# EasyEDA Pro project 课设作业.eprj, schematic Schematic1
Board Name: Board1; Create Date: 2025-06-27; Page Name: P1; Project Name: 课设作业; Schematic Name: Schematic1; Update Date: 2025-06-27; Company: 嘉立创EDA; Page Size: A4; Version: V1.0
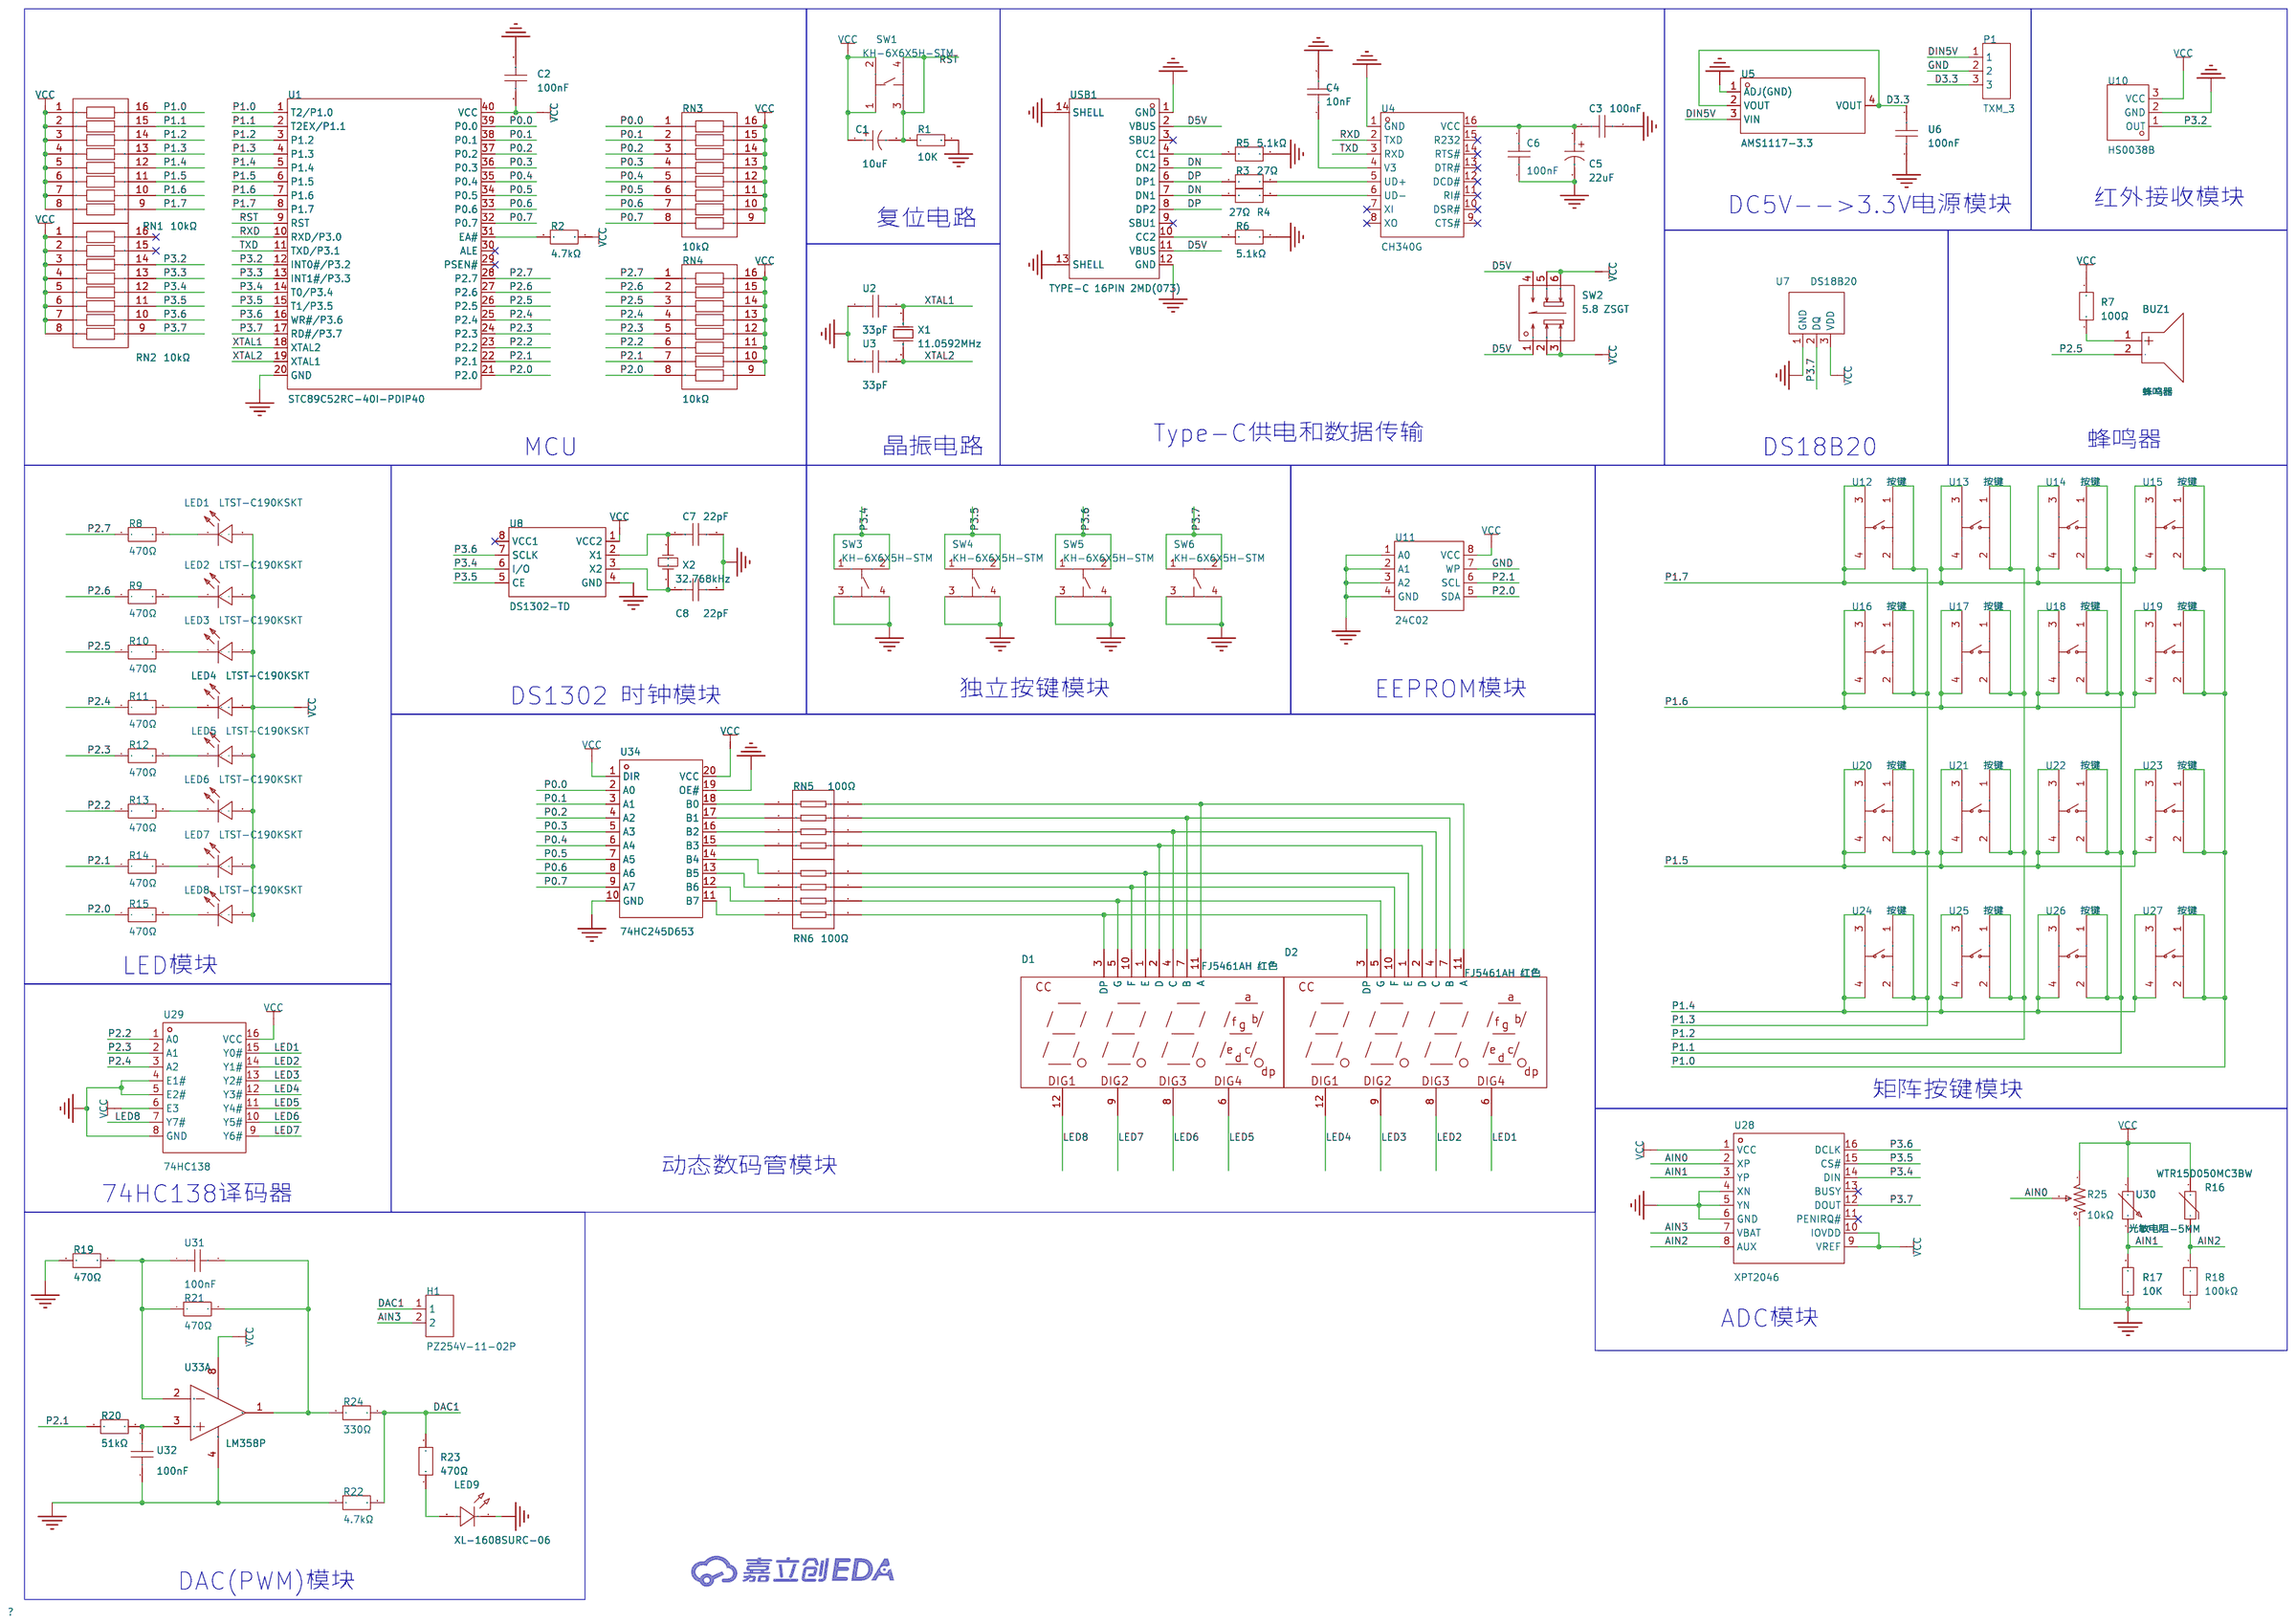
[diagram p0: schematic sheet]

## Parts
BUZ1  蜂鸣器  [BUZ-TH_BD9.0-P5.00-D0.6-FD]
C1  10uF  [CAP-TH_BD10.0-P5.00-D0.6-FD_1]
C2  100nF  [C0603]
C3  100nF  [C0603]
C4  10nF  [C0603]
C5  22uF  [CAP-SMD_BD5.0-L5.3-W5.3-LS6.0-FD-H5.7]
C6  100nF  [C0603]
C7  22pF  [C0603]
C8  22pF  [C0603]
D1  FJ5461AH 红色  [LED-SEG-TH_FJ5461AH]
D2  FJ5461AH 红色  [LED-SEG-TH_FJ5461AH]
H1  PZ254V-11-02P  [HDR-TH_2P-P2.54-V-M]
LED1  LTST-C190KSKT  [LED0603-RD]
LED2  LTST-C190KSKT  [LED0603-RD]
LED3  LTST-C190KSKT  [LED0603-RD]
LED4  LTST-C190KSKT  [LED0603-RD]
LED5  LTST-C190KSKT  [LED0603-RD]
LED6  LTST-C190KSKT  [LED0603-RD]
LED7  LTST-C190KSKT  [LED0603-RD]
LED8  LTST-C190KSKT  [LED0603-RD]
LED9  XL-1608SURC-06  [LED0603-RD_RED]
P1  TXM_3  [HDR-TH_3P-P2.54-V-M-A]
R1  10K  [R0603]
R2  4.7kΩ  [R0805]
R3  27Ω  [R0805]
R4  27Ω  [R0805]
R5  5.1kΩ  [R0603]
R6  5.1kΩ  [R0603]
R7  100Ω  [R1206]
R8  470Ω  [R0402]
R9  470Ω  [R0402]
R10  470Ω  [R0402]
R11  470Ω  [R0402]
R12  470Ω  [R0402]
R13  470Ω  [R0402]
R14  470Ω  [R0402]
R15  470Ω  [R0402]
R16  WTR15D050MC3BW  [RES-TH_L17.5-W6.0-P7.50-D0.8-S5.20]
R17  10K  [R0603]
R18  100kΩ  [R1206]
R19  470Ω  [R0402]
R20  51kΩ  [R1812]
R21  470Ω  [R0402]
R22  4.7kΩ  [R0603]
R23  470Ω  [R0402]
R24  330Ω  [R2010]
R25  10kΩ  [RES-ADJ-SMD_RM065-V1]
RN1  10kΩ  [DIP-16_L22.0-W6.7-P2.54-LS7.6-BL]
RN2  10kΩ  [DIP-16_L22.0-W6.7-P2.54-LS7.6-BL]
RN3  10kΩ  [DIP-16_L22.0-W6.7-P2.54-LS7.6-BL]
RN4  10kΩ  [DIP-16_L22.0-W6.7-P2.54-LS7.6-BL]
RN5  100Ω  [RES-ARRAY-SMD_0402-8P-L2.0-W1.0-BL]
RN6  100Ω  [RES-ARRAY-SMD_0402-8P-L2.0-W1.0-BL]
SW1  KH-6X6X5H-STM  [SW-SMD_4P-L6.0-W6.0-P4.50-LS9.0_H5.0]
SW2  5.8 ZSGT  [SW-TH_5.8ZSGT]
SW3  KH-6X6X5H-STM  [SW-SMD_4P-L6.0-W6.0-P4.50-LS9.0_H5.0]
SW4  KH-6X6X5H-STM  [SW-SMD_4P-L6.0-W6.0-P4.50-LS9.0_H5.0]
SW5  KH-6X6X5H-STM  [SW-SMD_4P-L6.0-W6.0-P4.50-LS9.0_H5.0]
SW6  KH-6X6X5H-STM  [SW-SMD_4P-L6.0-W6.0-P4.50-LS9.0_H5.0]
U1  STC89C52RC-40I-PDIP40  [DIP-40_L52.0-W13.7-P2.54-LS15.2-BL]
U2  33pF  [C0603]
U3  33pF  [C0603]
U4  CH340G  [SOIC-16_L9.9-W3.9-P1.27-LS6.0-BL]
U5  AMS1117-3.3  [SOT-223-3_L6.5-W3.4-P2.30-LS7.0-BR]
U6  100nF  [C0603]
U7  DS18B20  [TO-92-3_L4.6-W3.6-P1.27-L-1]
U8  DS1302-TD  [SOP-8_L4.9-W3.9-P1.27-LS6.0-BL]
U10  HS0038B  [OPTO-TH_HS0038B-A]
U11  24C02  [SOP-8_L4.9-W3.9-P1.27-LS6.0-BL]
U12  按键  [SW-SMD_4P-L6.0-W6.0-P4.50-LS9.0-2]
U13  按键  [SW-SMD_4P-L6.0-W6.0-P4.50-LS9.0-2]
U14  按键  [SW-SMD_4P-L6.0-W6.0-P4.50-LS9.0-2]
U15  按键  [SW-SMD_4P-L6.0-W6.0-P4.50-LS9.0-2]
U16  按键  [SW-SMD_4P-L6.0-W6.0-P4.50-LS9.0-2]
U17  按键  [SW-SMD_4P-L6.0-W6.0-P4.50-LS9.0-2]
U18  按键  [SW-SMD_4P-L6.0-W6.0-P4.50-LS9.0-2]
U19  按键  [SW-SMD_4P-L6.0-W6.0-P4.50-LS9.0-2]
U20  按键  [SW-SMD_4P-L6.0-W6.0-P4.50-LS9.0-2]
U21  按键  [SW-SMD_4P-L6.0-W6.0-P4.50-LS9.0-2]
U22  按键  [SW-SMD_4P-L6.0-W6.0-P4.50-LS9.0-2]
U23  按键  [SW-SMD_4P-L6.0-W6.0-P4.50-LS9.0-2]
U24  按键  [SW-SMD_4P-L6.0-W6.0-P4.50-LS9.0-2]
U25  按键  [SW-SMD_4P-L6.0-W6.0-P4.50-LS9.0-2]
U26  按键  [SW-SMD_4P-L6.0-W6.0-P4.50-LS9.0-2]
U27  按键  [SW-SMD_4P-L6.0-W6.0-P4.50-LS9.0-2]
U28  XPT2046  [TSSOP-16_L5.0-W4.4-P0.65-LS6.4-BL]
U29  74HC138  [SOIC-16_L9.9-W3.9-P1.27-LS6.0-BL]
U30  光敏电阻-5MM  [RES-TH_L4.9-W4.3-P3.4]
U31  100nF  [C0603]
U32  100nF  [C0603]
U33  LM358P  [DIP-8_L9.7-W6.4-P2.54-LS7.6-BL]  (section 1)
U34  74HC245D653  [SOIC-20_L13.0-W7.6-P1.27-LS10.3-BL]
USB1  TYPE-C 16PIN 2MD(073)  [USB-C-SMD_TYPE-C-6PIN-2MD-073]
X1  11.0592MHz  [HC-49US_L11.5-W4.5-P4.88]
X2  32.768kHz  [OSC-TH_BD3.1-P0.8-D0.3]

## Library data of the parts
BUZ1 = 蜂鸣器: Supplier Part: C9900020875; Supplier Footprint: 插件; JLCPCB Part Class: 扩展库; Supplier: LCSC
C1 = CV100MPA16B: LCSC Part Name: 10uF ±20% 450V; Supplier Part: C911241; Manufacturer: TWBOR(伯鸿); Supplier Footprint: 插件,D10xL16mm; JLCPCB Part Class: 扩展库; Datasheet: https://atta.szlcsc.com/upload/public/pdf/source/20201117/C911241_08C53D140102C9DE5D4425A5E1B3FE4F.pdf; Supplier: LCSC; Tolerance: ±20%; Voltage Rating: 450V; Ripple Current: 200mA@100kHz; Equivalent Series Resistance(ESR): 9Ω@100kHz; Pin Spacing: 5mm; Diameter: 10mm; Height - Seated (Max): 16mm; Lifetime: 5000hrs@105℃; Operating Temperature: -25℃~+105℃
C2 C3 C6 = 0603X7R104K250NT: 容值:100nF;精度:±10%;额定电压:25V;温度系数:X7R;; LCSC Part Name: 100nF ±10% 25V; Supplier Part: C48579280; Manufacturer: AIDE(爱迪电容); Supplier Footprint: 0603; JLCPCB Part Class: 扩展库; Datasheet: https://atta.szlcsc.com/upload/public/pdf/source/20210330/C2691711_5D01E1D4D7BF54205139C8425089DFE9.pdf; Supplier: LCSC; Tolerance: ±10%; Voltage Rating: 25V; Temperature Coefficient: X7R
C4 = C0603X103K2RECAUTO: 容值:10nF;精度:±10%;额定电压:200V;温度系数:X7R;; LCSC Part Name: 10nF ±10% 200V; Supplier Part: C2179446; Manufacturer: KEMET(基美); Supplier Footprint: 0603; JLCPCB Part Class: 扩展库; Datasheet: https://atta.szlcsc.com/upload/public/pdf/source/20210401/9EB15DD54C62581D346AFC10D664EB43.pdf; Supplier: LCSC; Tolerance: ±10%; Voltage Rating: 200V; Temperature Coefficient: X7R
C5 = JVE35V22M5X6: 容值:22uF;精度:±20%;额定电压:35V;纹波电流:95mA@120Hz;等效串联电阻(ESR):1.8Ω;; LCSC Part Name: 22uF ±20% 35V; Supplier Part: C48615118; Manufacturer: 捷而瑞; Supplier Footprint: SMD,D5xL5.7mm; JLCPCB Part Class: 扩展库; Datasheet: https://atta.szlcsc.com/upload/public/pdf/source/20250526/77E8EF678E4424190D47C2A54E1D535C.pdf; Supplier: LCSC; Tolerance: ±20%; Voltage Rating: 35V; Ripple Current: 95mA@120Hz; Equivalent Series Resistance(ESR): 1.8Ω; Diameter: 5mm; Height - Seated (Max): 5.7mm; Operating Temperature: -55℃~+105℃
C7 C8 = C0603C220K4GACAUTO: 容值:22pF;精度:±10%;额定电压:16V;温度系数:C0G;; LCSC Part Name: 22pF ±10% 16V; Supplier Part: C3895371; Manufacturer: KEMET(基美); Supplier Footprint: 0603; JLCPCB Part Class: 扩展库; Datasheet: https://atta.szlcsc.com/upload/public/pdf/source/20240118/0C4544E56C9B5C380B59302B893D963C.pdf; Supplier: LCSC; Tolerance: ±10%; Voltage Rating: 16V; Temperature Coefficient: C0G
D1 D2 = FJ5461AH 红色: LCSC Part Name: 4位0.56英寸红色数码管 共阴极; Supplier Part: C54396; Manufacturer: 志浩; Supplier Footprint: 插件; JLCPCB Part Class: 扩展库; Datasheet: https://atta.szlcsc.com/upload/public/pdf/source/20151111/1457707576636.pdf; Supplier: LCSC; Number of Characters: 4位; Display Type: 7段; Luminous Color: 红色; LED Polarity: 共阴极; Digit/Alpha Size(inch): 0.56
H1 = PZ254V-11-02P: LCSC Part Name: 1x2P 间距:2.54mm 方针 直插; Supplier Part: C492401; Manufacturer: XFCN(兴飞); Supplier Footprint: 插件,P=2.54mm; JLCPCB Part Class: 扩展库; Datasheet: https://atta.szlcsc.com/upload/public/pdf/source/20200309/C492401_A812433581A9B211A7FFA413ADDFF0E5.pdf; Supplier: LCSC; Pin Structure: 1x2P; Pitch: 2.54mm; Circluar Pins/Square Pins: 方针; Mounting Type: 直插; Number of Rows: 单排; Number of Pins: 2P; Length of Mating Pin: 6mm; Insulation Height: 2.5mm; Length of End Connection Pin: 3mm; Contact Material: 黄铜; Operating Temperature: -40℃~+105℃; Color: 黑色
LED1-LED8 = LTST-C190KSKT: 发光颜色:黄色;正向电压(VF):2.1V;功率:75mW;正向电流:20mA;主波长:584.5nm~597nm;二极管配置:-;透镜颜色:无色透明透镜;色温:-;发光强度:104mcd;发光角度:130°;载带方式:-;工作温度:-30℃~+85℃;; LCSC Part Name: 黄灯; Supplier Part: C125095; Manufacturer: LITEON(光宝); Supplier Footprint: 0603; JLCPCB Part Class: 扩展库; Datasheet: https://atta.szlcsc.com/upload/public/pdf/source/20180129/C125095_15171881843821315881.pdf; Supplier: LCSC; Emitted Color: 黄色; Forward Voltage (VF): 2.1V; Power Dissipation: 75mW; Forward Current: 20mA; Dominant Wavelength: 584.5nm~597nm; Peak Wavelength: 588nm; Lens Color: 无色透明透镜; Luminous Intensity: 104mcd; Viewing Angle: 130°; Operating Temperature: -30℃~+85℃
LED9 = XL-1608SURC-06: Supplier Part: C965799; Manufacturer: XINGLIGHT(成兴光); Supplier Footprint: 0603; JLCPCB Part Class: 扩展库; Datasheet: https://atta.szlcsc.com/upload/public/pdf/source/20250213/F9766CE804AF391355DCDD48DB3E0DAB.pdf; Supplier: LCSC; Illumination Color: 红色; Voltage - Forward(Vf): 2.3V; Power(Watts): 50mW; Forward Current: 20mA; Wavelength - Dominant: 620nm~630nm; Peak Wavelength: 625nm; Lens Color: 无色透明透镜; Luminous Intensity: 225mcd; Viewing Angle: 120°; Mounting Sytle: 正贴; Operating Temperature: -20℃~+85℃
P1 = TXM_3: Supplier Part: C9900014923; Supplier Footprint: 排针; JLCPCB Part Class: 扩展库; Supplier: LCSC
R1 R17 = Res_0603: Supplier Footprint: 0603
R2 = ERJ-U06F4701V: 电阻类型:厚膜电阻;阻值:4.7kΩ;精度:±1%;功率:125mW;工作电压:-;温度系数:±100ppm/℃;; LCSC Part Name: 4.7kΩ ±1% 125mW 厚膜电阻; Supplier Part: C1859462; Manufacturer: PANASONIC(松下); Supplier Footprint: 0805; JLCPCB Part Class: 扩展库; Datasheet: https://atta.szlcsc.com/upload/public/pdf/source/20210624/C1859462_0DC8A541405FCF91B34CFE3F505433C6.pdf; Supplier: LCSC; Type: 厚膜电阻; Tolerance: ±1%; Power(Watts): 125mW; Temperature Coefficient: ±100ppm/℃; Operating Temperature: -55℃~+155℃
R3 R4 = FRC0805J270 TS: 电阻类型:厚膜电阻;阻值:27Ω;精度:±5%;功率:125mW;工作电压:150V;温度系数:±100ppm/℃;; LCSC Part Name: 27Ω ±5% 125mW 厚膜电阻; Supplier Part: C2907314; Manufacturer: FOJAN(富捷); Supplier Footprint: 0805; JLCPCB Part Class: 扩展库; Datasheet: https://atta.szlcsc.com/upload/public/pdf/source/20211221/925EC7D7225764EE0046F22065062C87.pdf; Supplier: LCSC; Type: 厚膜电阻; Tolerance: ±5%; Power(Watts): 125mW; Voltage-Supply(Max): 150V; Temperature Coefficient: ±100ppm/℃; Operating Temperature: -55℃~+155℃
R5 R6 = RNCF0603TKW5K10: 电阻类型:薄膜电阻;阻值:5.1kΩ;精度:±0.01%;功率:100mW;温度系数:±2ppm/℃;; LCSC Part Name: 薄膜电阻 5.1kΩ ±0.01% 100mW; Supplier Part: C5863831; Manufacturer: SEI(Stackpole Electronics Inc.); Supplier Footprint: 0603; JLCPCB Part Class: 扩展库; Datasheet: https://atta.szlcsc.com/upload/public/pdf/source/20240328/A43EC6CDE744F29FBC58E37E114A4DE1.pdf; Supplier: LCSC; Type: 薄膜电阻; Tolerance: ±0.01%; Power(Watts): 100mW; Temperature Coefficient: ±2ppm/℃; Operating Temperature: -55℃~+155℃
R7 = CQ06W4J0101T5E: LCSC Part Name: 100Ω ±5% 250mW; Supplier Part: C2765667; Manufacturer: UNI-ROYAL(厚声); Supplier Footprint: 1206; JLCPCB Part Class: 扩展库; Datasheet: https://atta.szlcsc.com/upload/public/pdf/source/20210330/C2758625_90D19EEA9B8C23AA9BAF71D52BD1DB3E.pdf; Supplier: LCSC; Tolerance: ±5%; Power(Watts): 250mW; Voltage-Supply(Max): 200V; Operating Temperature: -55℃~+155℃
R8-R15 R19 R21 R23 = FRC0402F4700TS: 电阻类型:厚膜电阻;阻值:470Ω;精度:±1%;功率:62.5mW;工作电压:50V;温度系数:±100ppm/℃;; LCSC Part Name: 470Ω ±1% 62.5mW 厚膜电阻; Supplier Part: C2909361; Manufacturer: FOJAN(富捷); Supplier Footprint: 0402; JLCPCB Part Class: 扩展库; Datasheet: https://atta.szlcsc.com/upload/public/pdf/source/20211221/925EC7D7225764EE0046F22065062C87.pdf; Supplier: LCSC; Type: 厚膜电阻; Tolerance: ±1%; Power(Watts): 62.5mW; Voltage-Supply(Max): 50V; Temperature Coefficient: ±100ppm/℃; Operating Temperature: -55℃~+155℃
R16 = WTR15D050MC3BW: LCSC Part Name: 热敏电阻 5欧 (5D-15) 停产; Supplier Part: C523875; Manufacturer: WMEC(万明); Supplier Footprint: 插件,P=7.5mm; JLCPCB Part Class: 扩展库; Datasheet: https://atta.szlcsc.com/upload/public/pdf/source/20200428/C523875_85C4FDEE3F3521A14A711A7A31AE3BBE.pdf; Supplier: LCSC
R18 = WF12R1003DTL: LCSC Part Name: 100kΩ ±0.5%; Supplier Part: C5356709; Manufacturer: Walsin(华新科); Supplier Footprint: 1206; JLCPCB Part Class: 扩展库; Supplier: LCSC; Tolerance: ±0.5%
R20 = FRC1812J513 TS: LCSC Part Name: 51kΩ ±5% 750mW 厚膜电阻; Supplier Part: C2974084; Manufacturer: FOJAN(富捷); Supplier Footprint: 1812; JLCPCB Part Class: 扩展库; Datasheet: https://atta.szlcsc.com/upload/public/pdf/source/20211221/925EC7D7225764EE0046F22065062C87.pdf; Supplier: LCSC; Type: 厚膜电阻; Tolerance: ±5%; Power(Watts): 750mW; Voltage-Supply(Max): 200V; Temperature Coefficient: ±100ppm/℃; Operating Temperature: -55℃~+155℃
R22 = RCA034K7FLF: LCSC Part Name: 4.7kΩ ±1% 100mW; Supplier Part: C22369814; Manufacturer: HKR(香港电阻); Supplier Footprint: 0603; JLCPCB Part Class: 扩展库; Datasheet: https://atta.szlcsc.com/upload/public/pdf/source/20240327/626E23E3B2A799D2C85303DE2C37BB2A.pdf; Supplier: LCSC; Tolerance: ±1%; Power(Watts): 100mW
R24 = AC2010JK-07330RL: LCSC Part Name: 厚膜电阻 330Ω ±5% 750mW; Supplier Part: C230891; Manufacturer: YAGEO(国巨); Supplier Footprint: 2010; JLCPCB Part Class: 扩展库; Datasheet: https://atta.szlcsc.com/upload/public/pdf/source/20220908/2377BBF074CA7A353C80F8E24A015698.pdf; Supplier: LCSC; Type: 厚膜电阻; Tolerance: ±5%; Power(Watts): 750mW; Temperature Coefficient: ±100ppm/℃; Operating Temperature: -55℃~+155℃
R25 = RM065-103(10K): LCSC Part Name: 10kΩ ±25%; Supplier Part: C5205021; Manufacturer: BOCHEN(博晨); Supplier Footprint: 插件; JLCPCB Part Class: 扩展库; Datasheet: https://atta.szlcsc.com/upload/public/pdf/source/20221019/6263C46FBC7F1B66CBAADA74DC5EFAA2.pdf; Supplier: LCSC; Tolerance: ±25%; Power(Watts): 100mW
RN1-RN4 = 4116R-1-103LF: 电阻器数:8;阻值:10kΩ;精度:±2%;单个元件功率:250mW;温度系数:±100ppm/℃;; LCSC Part Name: 10kΩ ±2%; Supplier Part: C6087381; Manufacturer: BOURNS; Supplier Footprint: DIP-16; Datasheet: https://atta.szlcsc.com/upload/public/pdf/source/20210630/3D9C012B231BA1D1C9C6139B97130D1A.pdf; Supplier: LCSC; Number of Resistors: 8; Tolerance: ±2%; Power(Watts): 250mW; Temperature Coefficient: ±100ppm/℃; Number of Pins: 16
RN5 RN6 = 4D02WGJ0101TCE: LCSC Part Name: 100Ω ±5%; Supplier Part: C48442; Manufacturer: UNI-ROYAL(厚声); Supplier Footprint: 0402x4; JLCPCB Part Class: 扩展库; Datasheet: https://atta.szlcsc.com/upload/public/pdf/source/20191224/C474318_2527498AE30E813171187CCD28401A71.pdf; Supplier: LCSC; Number of Resistors: 4; Tolerance: ±5%; Power(Watts): 62.5mW; Temperature Coefficient: ±200ppm/℃; Number of Pins: 8
SW1 SW3-SW6 = KH-6X6X5H-STM: LCSC Part Name: 6*6*5mm 立贴 轻触开关; Supplier Part: C2837531; Manufacturer: kinghelm(金航标); Supplier Footprint: SMD; JLCPCB Part Class: 扩展库; Datasheet: https://atta.szlcsc.com/upload/public/pdf/source/20210608/C2837531_45E87AB996CE723B09405FF2EA209C4C.pdf; Supplier: LCSC; Circuit: 单刀单掷; Actuator Style: 圆形按钮; Mounting Style: 立贴; Switch Length: 6mm; Switch Width: 6mm; Switch Height: 5mm; Strike Gundam: 不带; Contact Current: 50mA; Voltage Rating (DC): 12V; Actuator/Cap Color: 黑色; Pin Style: 鸥翼型; Mechanical Life: 8万次
SW2 = 5.8 ZSGT: 电路结构:双刀双掷;自锁/无锁:自锁;安装方式:直插;触点电流:110mA;额定电压 (DC):30V;带灯:不带;作用力:1.5N;机械寿命:10万次;; LCSC Part Name: 5.8*5.8有头/高头 带锁/自锁开关 泡泡机开关; Supplier Part: C2681587; Manufacturer: SHOU HAN(首韩); Supplier Footprint: 插件; JLCPCB Part Class: 扩展库; Datasheet: https://atta.szlcsc.com/upload/public/pdf/source/20210107/C2681587_CDDDDA4A1C7AC9FEB01815B75893A6BA.pdf; Supplier: LCSC; Circuit: 双刀双掷; Self Lock / No Lock: 自锁; Actuator Style: 方形按钮; Mounting Style: 直插; Contact Current: 110mA; Voltage Rating (DC): 30V; Insulation Resistance: 100MΩ; Actuator/Cap Color: 白色; With Lamp: 不带; Pin Style: PC引脚; Operating Force: 1.5N; Operating Temperature: -10℃~+70℃; Mechanical Life: 10万次
U1 = STC89C52RC-40I-PDIP40: CPU内核:51系列;应用领域:-;; Supplier Part: C14022; Manufacturer: STC; Supplier Footprint: DIP-40; JLCPCB Part Class: 扩展库; Datasheet: https://atta.szlcsc.com/upload/public/pdf/source/20250219/C2F0DDDE7C5E9ADA5B33742D18630F09.pdf; Supplier: LCSC; CPU Core: 51系列; Program Storage Size: 8KB; Program Memory Type: FLASH; Number of I/O: 35; Voltage - Supply: 3.3V~5.5V
U2 U3 = GRM1885C1H330FA01D: 容值:33pF;精度:±1%;额定电压:50V;温度系数:-;; LCSC Part Name: 33pF ±1% 50V; Supplier Part: C882522; Manufacturer: muRata(村田); Supplier Footprint: 0603; JLCPCB Part Class: 扩展库; Datasheet: https://atta.szlcsc.com/upload/public/pdf/source/20200305/C490387_23319AE8C154DEB24C505E6C82A8106A.pdf; Supplier: LCSC; Tolerance: ±1%; Voltage Rating: 50V
U4 = CH340G: 应用功能:USB转UART;接口协议:USB 2.0;数据速率:2Mbps;; LCSC Part Name: USB转串口芯片CH340; Supplier Part: C14267; Manufacturer: WCH(南京沁恒); Supplier Footprint: SOP-16; JLCPCB Part Class: 扩展库; Datasheet: https://atta.szlcsc.com/upload/public/pdf/source/20240313/8510303D24D987FBF1AD30058571F10E.pdf; Supplier: LCSC; Applications Function: USB转UART; Protocol: USB 2.0; Supply Voltage: 5V；3.3V; Data Rate: 2Mbps; Operating Temperature: -40℃~+85℃
U5 = AMS1117-3.3: LCSC Part Name: 输入18V 输出3.3V 1A; Supplier Part: C2891839; Manufacturer: YONGYUTAI(永裕泰); Supplier Footprint: SOT-223-3; JLCPCB Part Class: 扩展库; Datasheet: https://atta.szlcsc.com/upload/public/pdf/source/20210901/A75ADDE6A17DEE0002F2A58A8D1F3634.pdf; Supplier: LCSC; Output Type: 固定; Maximum Input Voltage: 18V; Output Voltage: 3.3V; MAX Output Current: 1A; Power Supply Rejection Ratio (PSRR): 60dB@(120Hz); Dropout Voltage: 1.3V@(1A); standby current: 5mA; Noise: 0.005%Vout; Operating Temperature: -40℃~+125℃@(Tj); Output Polarity: 正极; Number of Outputs: 1
U6 U31 U32 = 0603Y0160104JDR: LCSC Part Name: 100nF ±5% 16V; Supplier Part: C2311333; Manufacturer: Knowles(楼氏); Supplier Footprint: 0603; Datasheet: https://atta.szlcsc.com/upload/public/pdf/source/20240118/355A526762AA184C363CF7E38A2497B6.pdf; Supplier: LCSC; Tolerance: ±5%; Voltage Rating: 16V
U7 = DS18B20: LCSC Part Name: 数字温度传感芯片; Supplier Part: C20611523; Manufacturer: Mysentech(敏源传感); Supplier Footprint: TO-92; JLCPCB Part Class: 扩展库; Datasheet: https://atta.szlcsc.com/upload/public/pdf/source/20250611/B68F123D38162FE7340E258AB4678475.pdf; Supplier: LCSC; Temperature Range: -55℃~+125℃; Tolerance: ±0.5℃; Voltage - Supply: 1.8V~5.5V; Standby Current: 200nA; Interface: 单总线
U8 = DS1302-TD: Supplier Part: C42421867; Manufacturer: TDSEMIC(拓电半导体); Supplier Footprint: SOP-8; Datasheet: https://atta.szlcsc.com/upload/public/pdf/source/20241227/D71829DAB4D2EBF8037287E820707CDC.pdf; Supplier: LCSC; Voltage - Supply: 2V~5.5V; Operating Temperature: -40℃~+85℃
U10 = HS0038B_C9900004117: Supplier Part: C9900004117; Supplier Footprint: 插件; JLCPCB Part Class: 扩展库; Supplier: LCSC
U11 = 24C02: LCSC Part Name: 24C02串行I2C总线EEPROM 停产; Supplier Part: C2984961; Manufacturer: HX(恒佳兴); Supplier Footprint: SOP-8; Datasheet: https://atta.szlcsc.com/upload/public/pdf/source/20220328/EEDD5B560A30EF54D50A97B6296179D0.pdf; Supplier: LCSC
U12-U27 = 按键: Supplier Part: C9900024939; Supplier Footprint: SW-SMD; JLCPCB Part Class: 扩展库; Supplier: LCSC
U28 = XPT2046: Supplier Part: C19076; Manufacturer: XPT(矽普特); Supplier Footprint: TSSOP-16; JLCPCB Part Class: 扩展库; Datasheet: https://atta.szlcsc.com/upload/public/pdf/source/20140801/1457707195762.pdf; Supplier: LCSC
U29 = 74HC138: LCSC Part Name: 停产; Supplier Part: C86611; Manufacturer: FM(富满); Supplier Footprint: SOIC-16; JLCPCB Part Class: 扩展库; Datasheet: https://atta.szlcsc.com/upload/public/pdf/source/20170103/1483435332227.pdf; Supplier: LCSC
U30 = 光敏电阻-5MM: Supplier Part: C9900003115; Supplier Footprint: RES-TH_4.3X4.9X3.37P; JLCPCB Part Class: 扩展库; Supplier: LCSC
U33 = LM358P_C5330384: Supplier Part: C5330384; Manufacturer: Slkor(萨科微); Supplier Footprint: DIP-8; JLCPCB Part Class: 扩展库; Datasheet: https://atta.szlcsc.com/upload/public/pdf/source/20240105/EDEF03A43059F7E7C713686EC280A486.pdf; Supplier: LCSC; Number of Channels: 双路; Maximum Power Supply Range (Vdd-Vss): 36V; Gain Bandwidth Product: 1MHz; Vos - Input Offset Voltage: 2mV; Ib - Input Bias Current: 45nA; Common Mode Rejection Ratio(CMRR): 85dB; Operating Temperature: 0℃~+70℃
U34 = 74HC245D653: Supplier Part: C70245; Supplier Footprint: SOIC-20-300mil; JLCPCB Part Class: 扩展库; Supplier: LCSC
USB1 = TYPE-C 16PIN 2MD(073): 连接器类型:Type-C;协议标准:USB 3.1;公母:母;安装方式:卧贴;触点数量:16P;端口数量:1;额定电流 - 电源:3A;工作温度:-25℃~+85℃;; LCSC Part Name: Type-C 母 卧贴; Supplier Part: C2765186; Manufacturer: SHOU HAN(首韩); Supplier Footprint: SMD; JLCPCB Part Class: 扩展库; Datasheet: https://atta.szlcsc.com/upload/public/pdf/source/20250506/FFB74EDFDFA0AC372CE4A8E4F739CCEF.pdf; Supplier: LCSC; Connector Type: Type-C; Protocol Standard: USB 3.1; Gender: 母; Mounting Type: 卧贴; Number of Contacts: 16P; Number of Ports: 1; Current Rating-Power: 3A; Voltage Rating: 5V; Connect-Disconnect Life: 5千次; Detection color: 黑色; Operating Temperature: -25℃~+85℃
X1 = X49SD110592MSD2SC: 晶振类型:直插晶振;频率:11.0592MHz;常温频差:±20ppm;负载电容:20pF;频率稳定度:±30ppm;; LCSC Part Name: HC-49US 11.0592MHZ 2P 49S 20PF ±20PPM -20~70℃（±30PPM）; Supplier Part: C2203; Manufacturer: YXC(扬兴晶振); Supplier Footprint: HC-49S; JLCPCB Part Class: 扩展库; Datasheet: https://atta.szlcsc.com/upload/public/pdf/source/20240329/977D7F2434F98B2BE33270BB9FF3D86D.pdf; Supplier: LCSC; Type: 直插晶振; Normal temperature Frequency Tolerance: ±20ppm; Load Capacitance: 20pF; Frequency Stability: ±30ppm; Operating Temperature: -20℃~+70℃
X2 = X308032768KGB2SC: LCSC Part Name: YT-38 32.768KHZ 2P 3080 12.5PF ±10PPM -20~70℃; Supplier Part: C52082; Manufacturer: YXC(扬兴晶振); Supplier Footprint: DT-38; JLCPCB Part Class: 扩展库; Datasheet: https://atta.szlcsc.com/upload/public/pdf/source/20240329/231E1A1EB7C875CD193DBE6664A3DE3A.pdf; Supplier: LCSC; Type: 直插晶振; Normal temperature Frequency Tolerance: ±10ppm; Load Capacitance: 12.5pF; Frequency Stability: ±20ppm; Operating Temperature: -20℃~+70℃

## Nets
D5V: SW2.1 SW2.4 USB1.2(VBUS) USB1.11(VBUS)
GND: C2.2 C3.2 C4.2 C5.2 C6.1 C7.2 C8.2 LED9.1(K) P1.2 R1.2 R5.2 R6.2 R17.1 R18.1 R19.1 R22.1 R25.1 SW3.3 SW3.4 SW4.3 SW4.4 SW5.3 SW5.4 SW6.3 SW6.4 U1.20(GND) U2.1 U3.2 U4.1(GND) U5.1(ADJ(GND)) U6.1 U7.1(GND) U8.4(GND) U10.2(GND) U11.1(A0) U11.2(A1) U11.3(A2) U11.4(GND) U11.7(WP) U28.4(XN) U28.5(YN) U28.6(GND) U29.4(E1#) U29.5(E2#) U29.8(GND) U32.1 U33.4(GND) U34.10(GND) U34.19(OE#) USB1.1(GND) USB1.12(GND) USB1.13(SHELL) USB1.14(SHELL)
VCC: C1.1 C2.1 LED1.2(+) LED2.2(+) LED3.2(+) LED4.2(+) LED5.2(+) LED6.2(+) LED7.2(+) LED8.2(+) R2.2 R7.2 R16.2 R25.3 RN1.1 RN1.2 RN1.3 RN1.4 RN1.5 RN1.6 RN1.7 RN1.8 RN2.1 RN2.2 RN2.3 RN2.4 RN2.5 RN2.6 RN2.7 RN2.8 RN3.9 RN3.10 RN3.11 RN3.12 RN3.13 RN3.14 RN3.15 RN3.16 RN4.9 RN4.10 RN4.11 RN4.12 RN4.13 RN4.14 RN4.15 RN4.16 SW1.1 SW1.2 SW2.2 SW2.3 SW2.5 SW2.6 U1.40(VCC) U7.3(VDD) U8.1(VCC2) U10.3(VCC) U11.8(VCC) U28.1(VCC) U28.9(VREF) U28.10(IOVDD) U29.6(E3) U29.16(VCC) U30.1 U33.8(VCC) U34.1(DIR) U34.20(VCC)
AIN0: R25.2 U28.2(XP)
AIN1: R17.2 U28.3(YP) U30.2
AIN2: R16.1 R18.2 U28.8(AUX)
AIN3: H1.2 U28.7(VBAT)
D3.3: P1.3 U5.2(VOUT) U5.4(VOUT) U6.2
DAC1: H1.1 R22.2 R23.2 R24.2
DIN5V: P1.1 U5.3(VIN)
DN: R4.1 USB1.5(DN2) USB1.7(DN1)
DP: R3.1 USB1.6(DP1) USB1.8(DP2)
LED1: D2.6(DIG4) U29.15(Y0#)
LED2: D2.8(DIG3) U29.14(Y1#)
LED3: D2.9(DIG2) U29.13(Y2#)
LED4: D2.12(DIG1) U29.12(Y3#)
LED5: D1.6(DIG4) U29.11(Y4#)
LED6: D1.8(DIG3) U29.10(Y5#)
LED7: D1.9(DIG2) U29.9(Y6#)
LED8: D1.12(DIG1) U29.7(Y7#)
P0.0: RN3.1 U1.39(P0.0) U34.2(A0)
P0.1: RN3.2 U1.38(P0.1) U34.3(A1)
P0.2: RN3.3 U1.37(P0.2) U34.4(A2)
P0.3: RN3.4 U1.36(P0.3) U34.5(A3)
P0.4: RN3.5 U1.35(P0.4) U34.6(A4)
P0.5: RN3.6 U1.34(P0.5) U34.7(A5)
P0.6: RN3.7 U1.33(P0.6) U34.8(A6)
P0.7: RN3.8 U1.32(P0.7) U34.9(A7)
P1.0: RN1.16 U1.1(T2/P1.0) U15.1 U15.2 U19.1 U19.2 U23.1 U23.2 U27.1 U27.2
P1.1: RN1.15 U1.2(T2EX/P1.1) U14.1 U14.2 U18.1 U18.2 U22.1 U22.2 U26.1 U26.2
P1.2: RN1.14 U1.3(P1.2) U13.1 U13.2 U17.1 U17.2 U21.1 U21.2 U25.1 U25.2
P1.3: RN1.13 U1.4(P1.3) U12.1 U12.2 U16.1 U16.2 U20.1 U20.2 U24.1 U24.2
P1.4: RN1.12 U1.5(P1.4) U24.3 U24.4 U25.3 U25.4 U26.3 U26.4 U27.3 U27.4
P1.5: RN1.11 U1.6(P1.5) U20.3 U20.4 U21.3 U21.4 U22.3 U22.4 U23.3 U23.4
P1.6: RN1.10 U1.7(P1.6) U16.3 U16.4 U17.3 U17.4 U18.3 U18.4 U19.3 U19.4
P1.7: RN1.9 U1.8(P1.7) U12.3 U12.4 U13.3 U13.4 U14.3 U14.4 U15.3 U15.4
P2.0: R15.1 RN4.8 U1.21(P2.0) U11.5(SDA)
P2.1: R14.1 R20.1 RN4.7 U1.22(P2.1) U11.6(SCL)
P2.2: R13.1 RN4.6 U1.23(P2.2) U29.1(A0)
P2.3: R12.1 RN4.5 U1.24(P2.3) U29.2(A1)
P2.4: R11.1 RN4.4 U1.25(P2.4) U29.3(A2)
P2.5: BUZ1.2(-) R10.1 RN4.3 U1.26(P2.5)
P2.6: R9.1 RN4.2 U1.27(P2.6)
P2.7: R8.1 RN4.1 U1.28(P2.7)
P3.2: RN2.14 U1.12(INT0#/P3.2) U10.1(OUT)
P3.3: RN2.13 U1.13(INT1#/P3.3)
P3.4: RN2.12 SW3.1 SW3.2 U1.14(T0/P3.4) U8.6(I/O) U28.14(DIN)
P3.5: RN2.11 SW4.1 SW4.2 U1.15(T1/P3.5) U8.5(CE) U28.15(CS#)
P3.6: RN2.10 SW5.1 SW5.2 U1.16(WR#/P3.6) U8.7(SCLK) U28.16(DCLK)
P3.7: RN2.9 SW6.1 SW6.2 U1.17(RD#/P3.7) U7.2(DQ) U28.12(DOUT)
RST: C1.2 R1.1 SW1.3 SW1.4 U1.9(RST)
RXD: U1.10(RXD/P3.0) U4.2(TXD)
TXD: U1.11(TXD/P3.1) U4.3(RXD)
XTAL1: U1.18(XTAL2) U2.2 X1.1(OSC1)
XTAL2: U1.19(XTAL1) U3.1 X1.2(OSC2)
$1N343: R2.1 U1.31(EA#)
$1N2430: R5.1 USB1.4(CC1)
$1N2431: R6.1 USB1.10(CC2)
$1N2434: R3.2 U4.5(UD+)
$1N2435: R4.2 U4.6(UD-)
$1N2436: C4.1 U4.4(V3)
$1N2449: C3.1 C5.1 C6.2 U4.16(VCC)
$1N3085: BUZ1.1(+) R7.1
$1N3747: LED1.1(-) R8.2
$1N3748: LED2.1(-) R9.2
$1N3749: LED3.1(-) R10.2
$1N3750: LED4.1(-) R11.2
$1N3751: LED5.1(-) R12.2
$1N3752: LED6.1(-) R13.2
$1N3753: LED7.1(-) R14.2
$1N3754: LED8.1(-) R15.2
$1N3965: C7.1 U8.2(X1) X2.2(OSC2)
$1N3966: C8.1 U8.3(X2) X2.1(OSC1)
$1N8435: R19.2 R21.1 U31.1 U33.2(IN1-)
$1N8496: R20.2 U32.2 U33.3(IN1+)
$1N8550: R21.2 R24.1 U31.2 U33.1(OUT1)
$1N8619: LED9.2(A) R23.1
$1N9345: RN5.1 U34.18(B0)
$1N9349: RN5.2 U34.17(B1)
$1N9354: RN5.3 U34.16(B2)
$1N9359: RN5.4 U34.15(B3)
$1N9364: RN6.1 U34.14(B4)
$1N9374: RN6.2 U34.13(B5)
$1N9380: RN6.3 U34.12(B6)
$1N9386: RN6.4 U34.11(B7)
$1N9929: D1.11(A) D2.11(A) RN5.8
$1N9944: D1.7(B) D2.7(B) RN5.7
$1N9973: D1.4(C) D2.4(C) RN5.6
$1N9989: D1.2(D) D2.2(D) RN5.5
$1N10005: D1.1(E) D2.1(E) RN6.8
$1N10021: D1.10(F) D2.10(F) RN6.7
$1N10037: D1.5(G) D2.5(G) RN6.6
$1N10053: D1.3(DP) D2.3(DP) RN6.5

Not connected (* = marked no-connect by the designer): RN2 15* 16*; U1 29(PSEN#)* 30(ALE)*; U4 7(XI)* 8(XO)* 9(CTS#)* 10(DSR#)* 11(RI#)* 12(DCD#)* 13(DTR#)* 14(RTS#)* 15(R232)*; U8 8(VCC1)*; U28 11(PENIRQ#)* 13(BUSY)*; USB1 3(SBU2)* 9(SBU1)*

## Notes on the sheet
- 红外接收模块
- DC5V-->3.3V电源模块
- 复位电路
- Type-C供电和数据传输
- 蜂鸣器
- MCU
- 晶振电路
- DS18B20
- 独立按键模块
- EEPROM模块
- DS1302 时钟模块
- LED模块
- 矩阵按键模块
- 动态数码管模块
- 74HC138译码器
- ADC模块
- DAC(PWM)模块
